# Altium project DAVT_Tung.PrjPcb
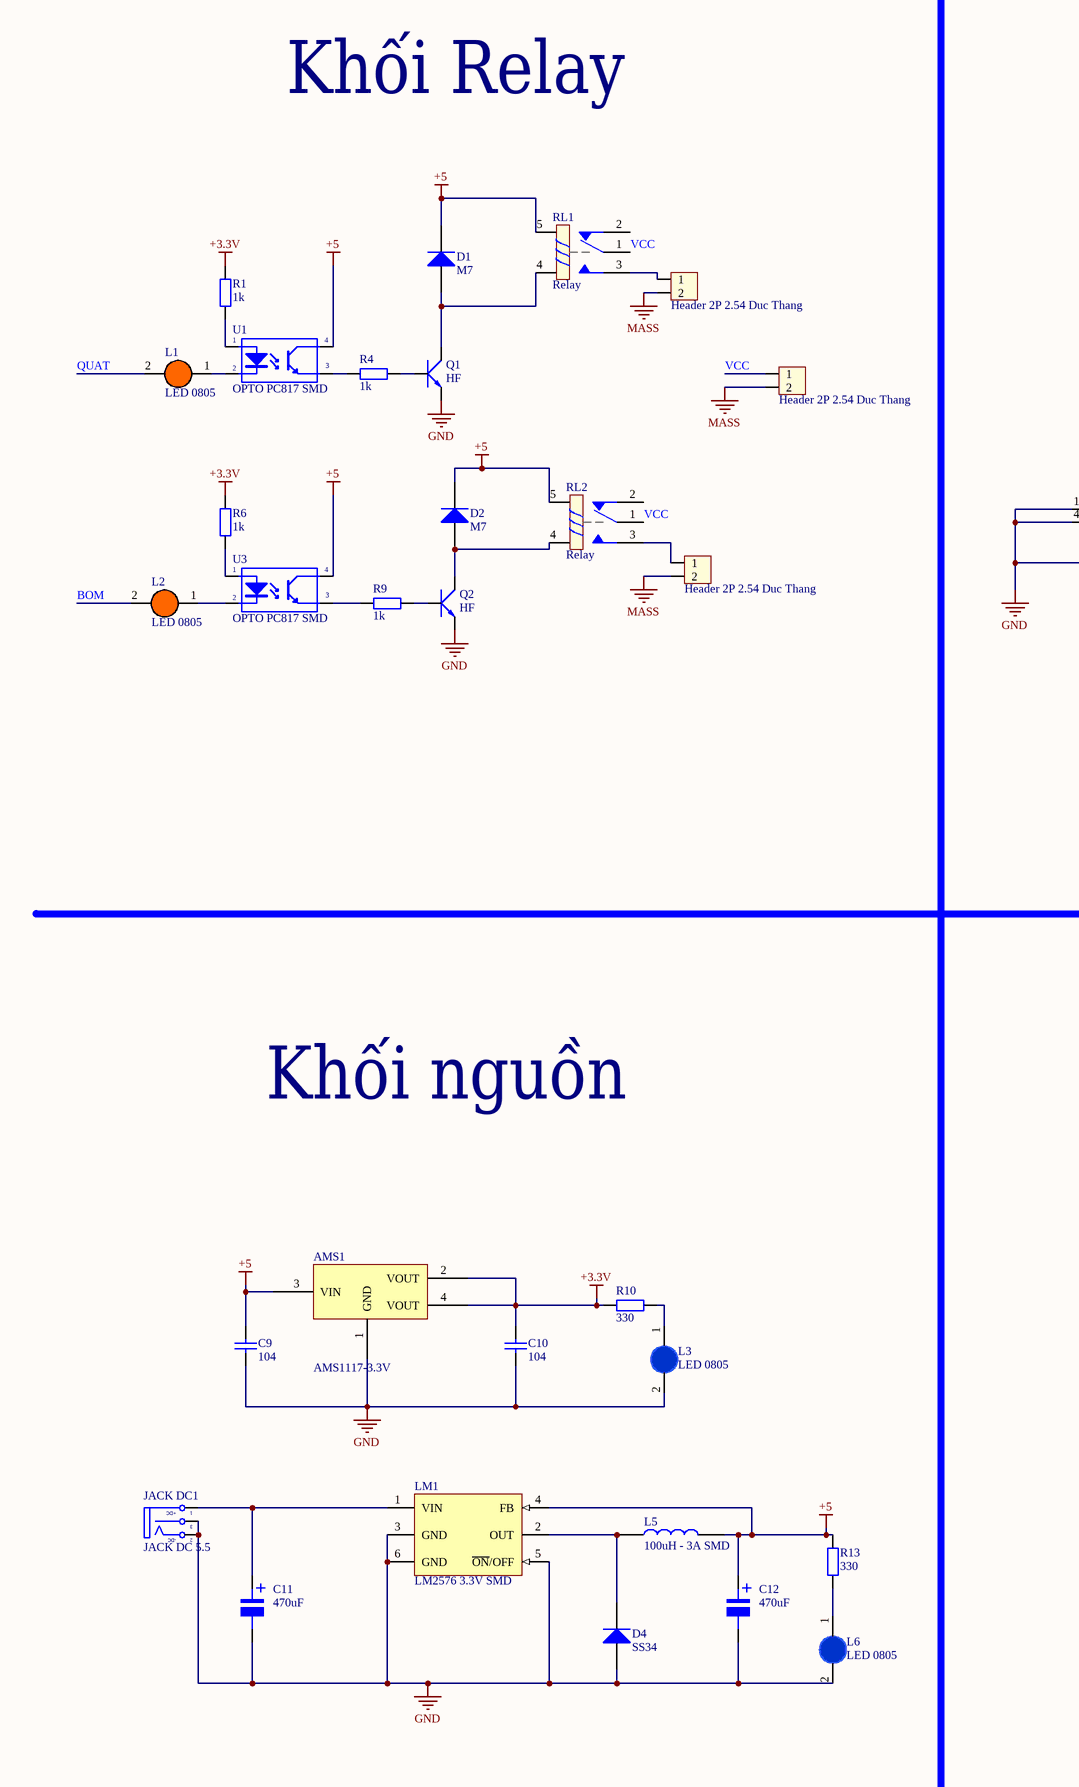
[diagram p0: Sheet7.SchDoc, left]
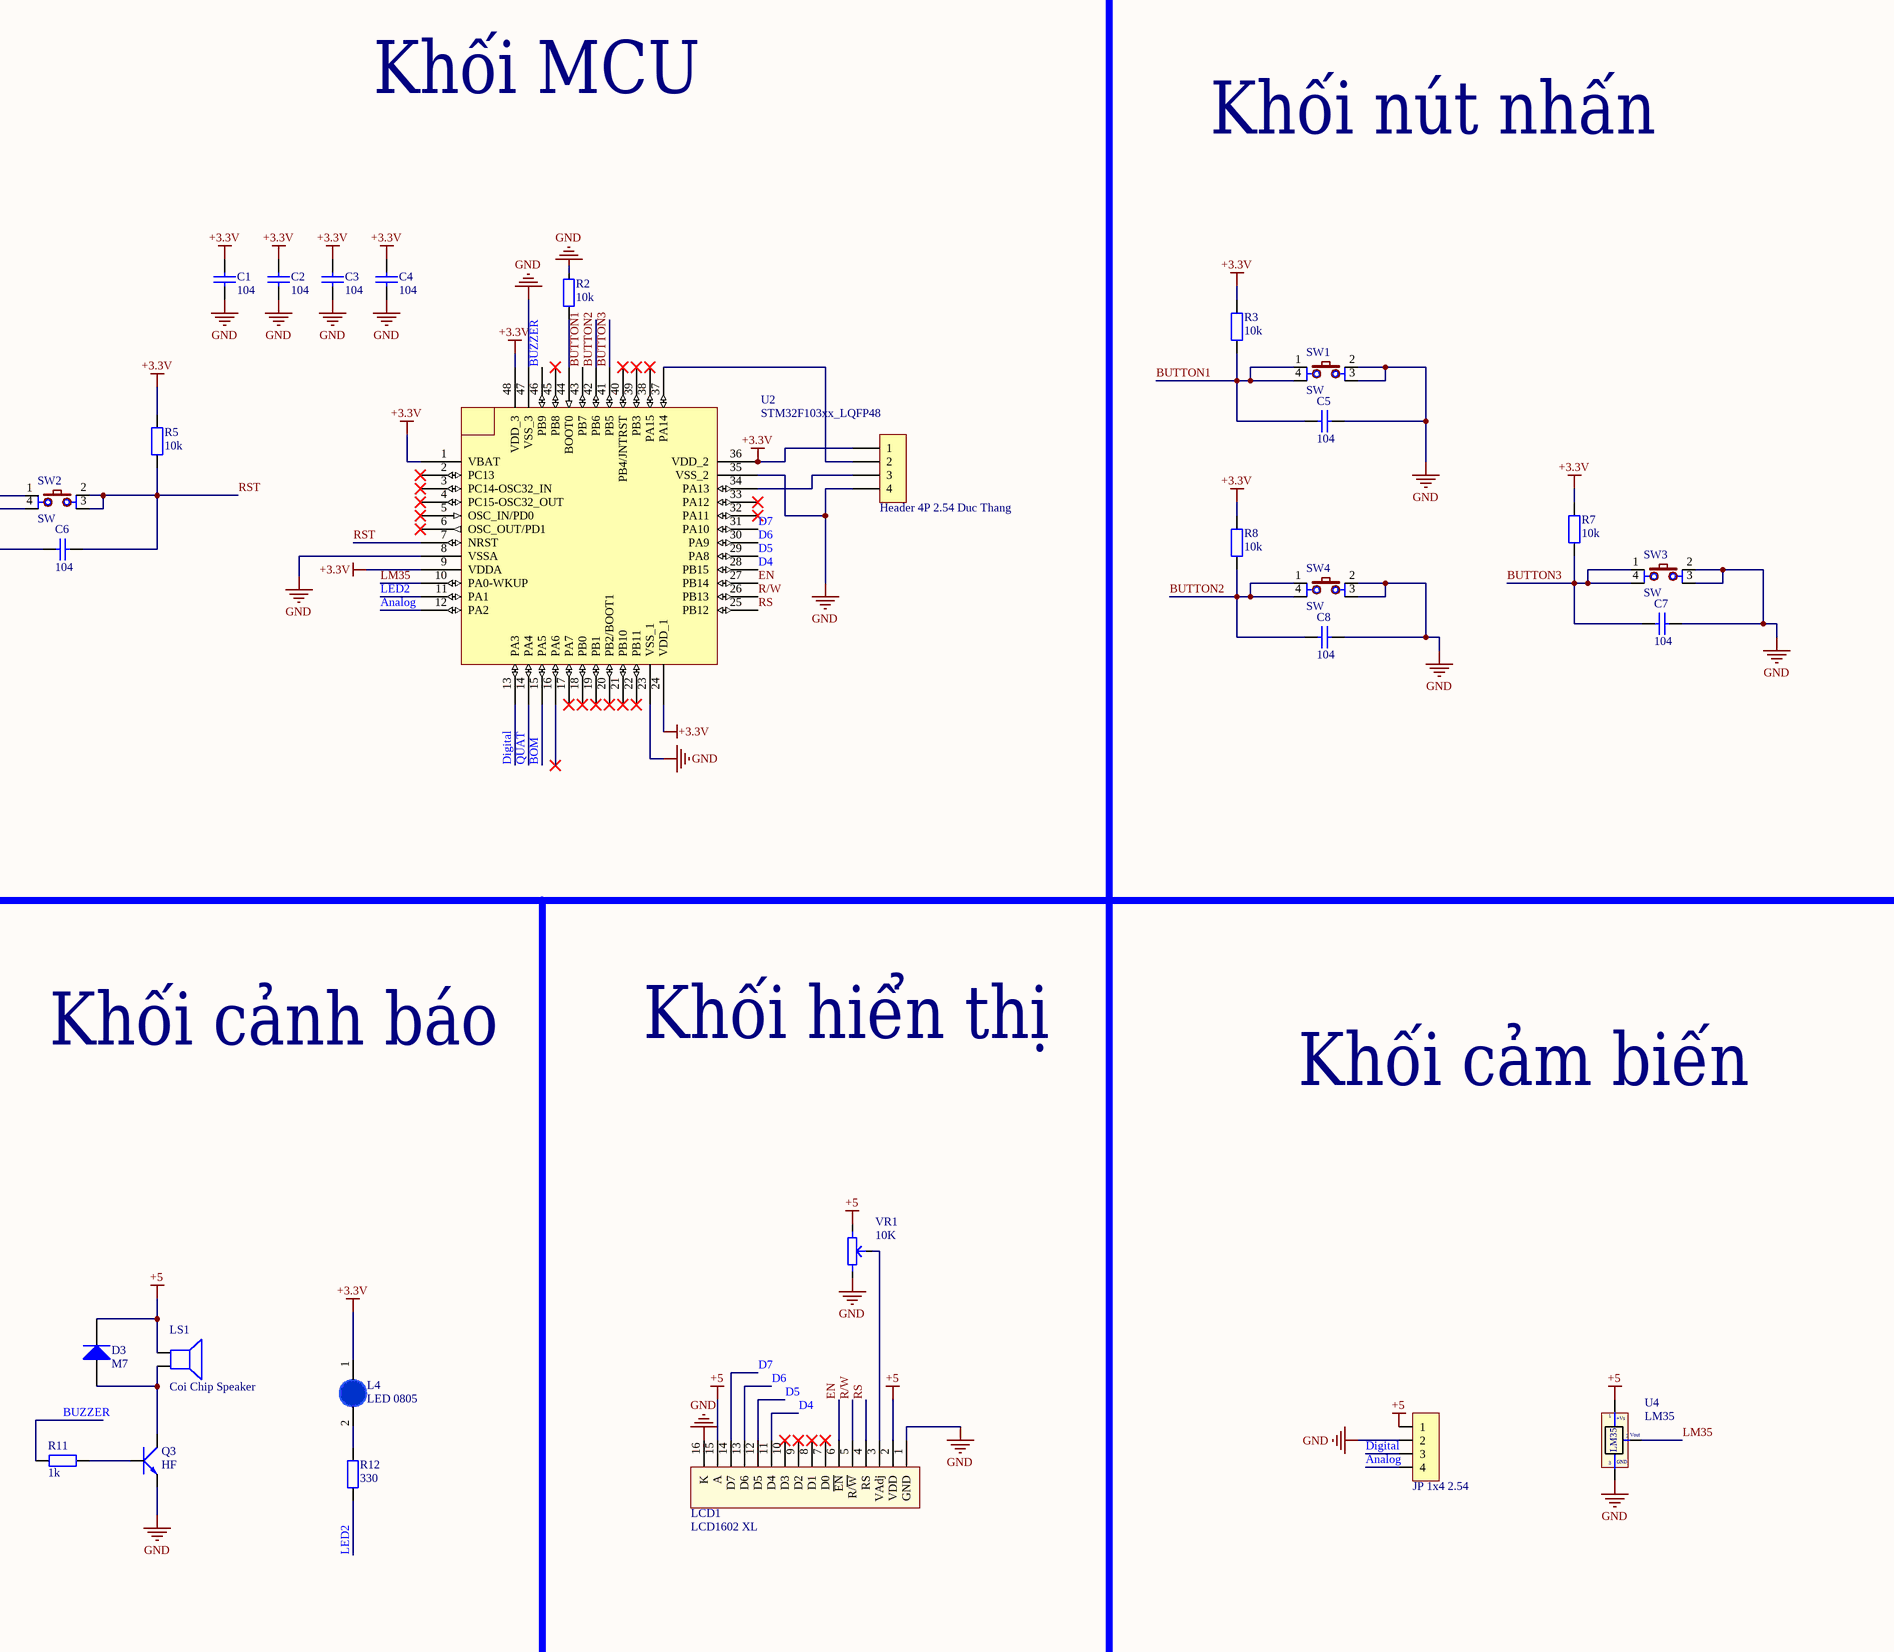
[diagram p1: Sheet7.SchDoc, right]
1 sheet, 59 parts. Net scope: global (net labels, ports and power ports of the same name join across sheets).
Board file: PCB6.PcbDoc

## Sheet Sheet7.SchDoc
size A2; SheetNumber: 1; SheetTotal: 1

### Parts
AMS1  AMS1117-3.3V  [SOT223]
C1  104  [tu 0805]
C2  104  [tu 0805]
C3  104  [tu 0805]
C4  104  [tu 0805]
C5  104  [tu 0805]
C6  104  [tu 0805]
C7  104  [tu 0805]
C8  104  [tu 0805]
C9  104  [tu 0805]
C10  104  [tu 0805]
C11  470uF  [tu nhom 8 (f)]
C12  470uF  [tu nhom 8 (f)]
D1  M7  [DIODE SMA]
D2  M7  [DIODE SMA]
D3  M7  [DIODE SMA]
D4  SS34  [DIODE SMA]
H1  Header 2P 2.54 Duc Thang  [XH2.54M-2]
H3  Header 4P 2.54 Duc Thang  [XH2.54M-4]
H7  Header 2P 2.54 Duc Thang  [XH2.54M-2]
H8  Header 2P 2.54 Duc Thang  [XH2.54M-2]
JACK_DC1  JACK DC 5.5  [JACK DC 5.5]
JP1  JP 1x4 2.54  [JP 1x4 CT]
L1  LED 0805  [LED-0805-Orange]
L2  LED 0805  [LED-0805-Orange]
L3  LED 0805  [LED-0805-Blue]
L4  LED 0805  [LED-0805-Blue]
L5  100uH - 3A SMD  [Cuon Cam 12x12x10]
L6  LED 0805  [LED-0805-Blue]
LCD1  LCD1602 XL  [LCD1602 with Jump]
LM1  LM2576 3.3V SMD  [TO263-5]
LS1  Coi Chip Speaker  [Coi Chip Speacker]
Q1  HF  [SOT-23]
Q2  HF  [SOT-23]
Q3  HF  [SOT-23]
R1  1k  [tro smd 0805]
R2  10k  [tro smd 0805]
R3  10k  [tro smd 0805]
R4  1k  [tro smd 0805]
R5  10k  [tro smd 0805]
R6  1k  [tro smd 0805]
R7  10k  [tro smd 0805]
R8  10k  [tro smd 0805]
R9  1k  [tro smd 0805]
R10  330  [tro smd 0805]
R11  1k  [tro smd 0805]
R12  330  [tro smd 0805]
R13  330  [tro smd 0805]
RL1  Relay  [Relay 5 Chan SRD]
RL2  Relay  [Relay 5 Chan SRD]
SW1  SW  [SW2-DIP]
SW2  SW  [SW2-DIP]
SW3  SW  [SW2-DIP]
SW4  SW  [SW2-DIP]
U1  OPTO PC817 SMD  [SOP4]
U2  STM32F103xx_LQFP48  [STM32_LQPF48]
U3  OPTO PC817 SMD  [SOP4]
U4  LM35  [QTO-92]
VR1  10K  [Bien Tro Tam Giac Dung]

### Nets
+3.3V: AMS1.2(VOUT) AMS1.4(VOUT) C1.1 C2.1 C3.1 C4.1 C10.1 H3.1 L4.1(A) R1.2 R3.2 R5.2 R6.2 R7.2 R8.2 R10.2 U2.1(VBAT) U2.9(VDDA) U2.24(VDD_1) U2.36(VDD_2) U2.48(VDD_3)
+5: AMS1.3(VIN) C9.1 C12.1 D1.2(K) D2.2(K) D3.2(K) JP1.1 L5.2 LCD1.2(VDD) LCD1.15(A) LM1.4(FB) LS1.1 R13.2 RL1.5 RL2.5 U1.4(C) U3.4(C) U4.1(+Vs) VR1.1
GND: AMS1.1(GND) C1.2 C2.2 C3.2 C4.2 C5.2 C6.1 C7.2 C8.2 C9.2 C10.2 C11.2 C12.2 D4.1(A) H3.4 JACK_DC1.2(TN) JACK_DC1.3(S) JP1.2 L3.2(K) L6.2(K) LCD1.1(GND) LCD1.16(K) LM1.3(GND) LM1.5(~{ON}/OFF) LM1.6(GND) Q1.2(E) Q2.2(E) Q3.2(E) R2.2 SW1.2 SW1.3 SW2.1 SW2.4 SW3.2 SW3.3 SW4.2 SW4.3 U2.8(VSSA) U2.23(VSS_1) U2.35(VSS_2) U2.47(VSS_3) U4.3(-) VR1.3
MASS: H1.2 H7.2 H8.2
Analog: JP1.4 U2.12(PA2)
BOM: L2.2(K) U2.15(PA5)
BUTTON1: C5.1 R3.1 SW1.1 SW1.4 U2.43(PB7)
BUTTON2: C8.1 R8.1 SW4.1 SW4.4 U2.42(PB6)
BUTTON3: C7.1 R7.1 SW3.1 SW3.4 U2.41(PB5)
BUZZER: R11.1 U2.46(PB9)
D4: LCD1.11(D4) U2.28(PB15)
D5: LCD1.12(D5) U2.29(PA8)
D6: LCD1.13(D6) U2.30(PA9)
D7: LCD1.14(D7) U2.31(PA10)
Digital: JP1.3 U2.13(PA3)
EN: LCD1.6(~{EN}) U2.27(PB14)
LED2: R12.1 U2.11(PA1)
LM35: U2.10(PA0-WKUP) U4.2(Vout)
QUAT: L1.2(K) U2.14(PA4)
R/W: LCD1.5(R/~{W}) U2.26(PB13)
RS: LCD1.4(RS) U2.25(PB12)
RST: C6.2 R5.1 SW2.2 SW2.3 U2.7(NRST)
VCC: H7.1 RL1.1 RL2.1
NetC11_1: C11.1 JACK_DC1.1(T) LM1.1(VIN)
NetD1_1: D1.1(A) Q1.3(C) RL1.4
NetD2_1: D2.1(A) Q2.3(C) RL2.4
NetD3_1: D3.1(A) LS1.2 Q3.3(C)
NetD4_2: D4.2(K) L5.1 LM1.2(OUT)
NetH1_1: H1.1 RL1.3
NetH3_2: H3.2 U2.37(PA14)
NetH3_3: H3.3 U2.34(PA13)
NetH8_1: H8.1 RL2.3
NetL1_1: L1.1(A) U1.2(K)
NetL2_1: L2.1(A) U3.2(K)
NetL3_1: L3.1(A) R10.1
NetL4_2: L4.2(K) R12.2
NetL6_1: L6.1(A) R13.1
NetLCD1_3: LCD1.3(VAdj) VR1.2
NetQ1_1: Q1.1(B) R4.1
NetQ2_1: Q2.1(B) R9.1
NetQ3_1: Q3.1(B) R11.2
NetR1_1: R1.1 U1.1(A)
NetR2_1: R2.1 U2.44(BOOT0)
NetR4_2: R4.2 U1.3(E)
NetR6_1: R6.1 U3.1(A)
NetR9_2: R9.2 U3.3(E)

Not connected (* = marked no-connect by the designer): LCD1 7(D0)* 8(D1)* 9(D2)* 10(D3)*; RL1 2; RL2 2; U2 2(PC13)* 3(PC14-OSC32_IN)* 4(PC15-OSC32_OUT)* 5(OSC_IN/PD0)* 6(OSC_OUT/PD1)* 16(PA6)* 17(PA7)* 18(PB0)* 19(PB1)* 20(PB2/BOOT1)* 21(PB10)* 22(PB11)* 32(PA11)* 33(PA12)* 38(PA15)* 39(PB3)* 40(PB4/JNTRST)* 45(PB8)*

### Notes on the sheet
- Khối Relay
- Khối MCU
- Khối nút nhấn
- Khối cảnh báo
- Khối hiển thị
- Khối nguồn
- Khối cảm biến
- (in symbol JACK DC 5.5) +DC; -DC
- (in symbol LM35) GND
- (in symbol Tu Nhom 470uF 16V) +

### Library data of the parts
AMS1 = AMS1117 SMD: Dán; Value: AMS1117-3.3V SOT223; Don_Vi: Con; Ma_Hang: MH000596; Ghi_Chu: *; Kieu_Chan: *; Chung_Loai: Dán
C1-C10 = Tu 0805 104 50V 10%: Dán; Don_Vi: Con; So_Chan: 2; Ten_Linh_Kien: Tụ 0805 104-100nF 10% 50V; Ma_Hang: MH004551; Chung_Loai: Dán; Kieu_Chan: *
C11 C12 = Tu Nhom 470uF 16V: Dán; Don_Vi: Con; So_Chan: 2; Ten_Linh_Kien: Tụ Nhôm 470uF 16V 8x10.4MM; Ma_Hang: MH001940; Chung_Loai: Dán; Kieu_Chan: *
D1-D3 = Diode M7 ( 4007 ): Dán; Don_Vi: Con; Ten_Linh_Kien: Diode M7 1N4007 SMD 1A 1000V; Ma_Hang: MH000944; Chung_Loai: Dán; Ghi_Chu: *
D4 = Diode SS34 ( 1N5822 ): Dán; Don_Vi: Con; Ma_Hang: MH002104; Ten_Linh_Kien: Diode SS34 3A 40V SMA ( 1N5822 SS34A); Kieu_Chan: *; Chung_Loai: Dán
H1 H7 H8 = Header 2P 2.54 Duc Thang: Cắm; Ten_Linh_Kien: Header 2P XH2.54-2P Đực Thẳng; Don_Vi: Con; Ma_Hang: MH001283; Chung_Loai: Cắm
H3 = Header 4P 2.54 Duc Thang: Cắm; Ten_Linh_Kien: Header 4P XH2.54-4P Đực Thẳng; Don_Vi: Con; Ma_Hang: MH001285; Chung_Loai: Cắm
JACK_DC1 = JACK DC 5.5: Value: Jac DC
JP1 = JP 1x4 2.54 Cai Thang: Cắm; Ten_Linh_Kien: Jump Đơn Cái 2.54MM 1x20P Thẳng; Don_Vi: Con; Ma_Hang: MH004006; Ghi_Chu: *; Kieu_Chan: *; Chung_Loai: Cắm
L1 L2 = LED 0805 Cam: Dán; Don_Vi: Con; Ma_Hang: MH002328; Ten_Linh_Kien: LED 0805 Màu Cam ( Orange); Ghi_Chu: *; Kieu_Chan: *; Chung_Loai: Dán
L3 L4 L6 = LED 0805 Xanh Duong: Dán; Don_Vi: Con; Ma_Hang: MH002327; Ten_Linh_Kien: LED 0805 Màu Xanh Dương (Blue); Ghi_Chu: *; Kieu_Chan: *; Chung_Loai: Dán
L5 = CUON CAM 100uH SMD: Dán; Don_Vi: Con; Ma_Hang: MH003999; Ten_Linh_Kien: Cuộn Cảm 100uH 7x7x4MM CD74; Ma_Hang: *; Kieu_Chan: *; Chung_Loai: Dán
LCD1 = LCD1602 XL: LCD 1602 Xanh Lá; Ten: Màn hình LCD 1602 Xanh Lá; Ma_Hang: 67HZ; NCC: NSHOP; CHIP: HD44780
LM1 = LM2576 3.3V SMD: Dán; Don_Vi: Con; Ma_Hang: MH001260; Ten_Linh_Kien: LM2576S-3.3V BUCK 3.3V 3A TO263-5; Ghi_Chu: *; Kieu_Chan: *; Chung_Loai: Dán
LS1 = Coi Chip Speaker: Còi chip
Q1-Q3 = Trans C1815 HF SMD: SOT-23; Value: C9014
R1 R4 R6 R9 = Tro 0805 1% 1k: Dán; Don_Vi: Con; So_Chan: 2; Ten_Linh_Kien: Trở 0805 1% 1k; Ma_Hang: MH005468; Chung_Loai: Dán; Kieu_Chan: *
R2 R3 R5 R7 R8 R10-R13 = Tro 0805 1% 18k: Dán; Don_Vi: Con; So_Chan: 2; Ten_Linh_Kien: Trở 0805 1% 18k; Ma_Hang: MH005477; Chung_Loai: Dán; Kieu_Chan: *
RL1 RL2 = Relay 5 Chan SRD: Relay 5 Chan; Ma_Hang: MH009374; Ten: Relay 5V10A SRD-05VDC-SL-C Chính Hãng
SW1-SW4 = SW4: Switch button 4 pin; Value: Button chip 4 pin
U1 U3 = OPTO PC817 SMD: Single Opto; Value: PC817
U4 = LM35: Teminal; Value: LM35
VR1 = Bien tro tam giac 10K Dung: Cắm; Ma_Hang: MH000919; Don_Vi: Con; Ten_Linh_Kien: Biến Trở Tam Giác 103-10K RM065 (Chân Đứng); Chung_Loai: Cắm; Kieu_Chan: *
U2 = STM32F103xx_LQFP48: Published: 30-May-2008; DatasheetVersion: rev6, Mar-2008; PackageVersion: Mar-2008; PackageReference: LQFP48; Publisher: Altium Limited; PackageDescription: 48-Pin Low-Profile Quad Flat Pack, 7 x 7 mm Body, 0.5 mm Pitch (LQFP48); ComponentLink1Description: Manufacturer Link; ComponentLink1URL: www.st.com/stm32; ComponentLink2Description: Datasheet; ComponentLink2URL: http://www.st.com/stonline/products/literature/ds/13587.pdf